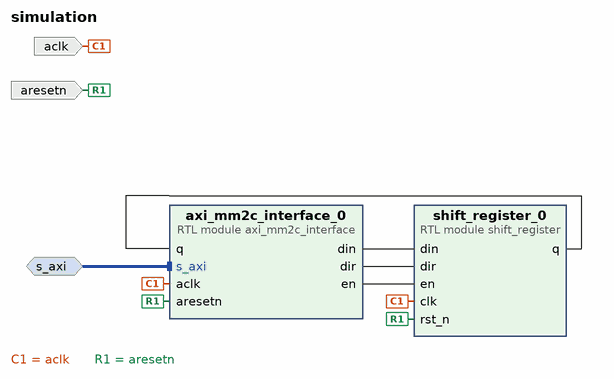
[diagram p0: block diagram of the top level]
# Vivado block design simulation, xc7z020clg484-1, Vivado 2023.2
create_bd_design simulation

create_bd_intf_port -mode Slave -vlnv xilinx.com:interface:aximm_rtl:1.0 s_axi
set_property -dict [list \
  CONFIG.ADDR_WIDTH 32 \
  CONFIG.ARUSER_WIDTH 0 \
  CONFIG.AWUSER_WIDTH 0 \
  CONFIG.BUSER_WIDTH 0 \
  CONFIG.DATA_WIDTH 32 \
  CONFIG.HAS_BRESP 1 \
  CONFIG.HAS_BURST 0 \
  CONFIG.HAS_CACHE 0 \
  CONFIG.HAS_LOCK 0 \
  CONFIG.HAS_PROT 0 \
  CONFIG.HAS_QOS 0 \
  CONFIG.HAS_REGION 0 \
  CONFIG.HAS_RRESP 1 \
  CONFIG.HAS_WSTRB 1 \
  CONFIG.ID_WIDTH 0 \
  CONFIG.MAX_BURST_LENGTH 1 \
  CONFIG.NUM_READ_OUTSTANDING 1 \
  CONFIG.NUM_READ_THREADS 1 \
  CONFIG.NUM_WRITE_OUTSTANDING 1 \
  CONFIG.NUM_WRITE_THREADS 1 \
  CONFIG.PROTOCOL AXI4LITE \
  CONFIG.READ_WRITE_MODE READ_WRITE \
  CONFIG.RUSER_BITS_PER_BYTE 0 \
  CONFIG.RUSER_WIDTH 0 \
  CONFIG.SUPPORTS_NARROW_BURST 0 \
  CONFIG.WUSER_BITS_PER_BYTE 0 \
  CONFIG.WUSER_WIDTH 0 \
] [get_bd_intf_ports s_axi]
create_bd_port -dir I -type clk aclk
set_property -dict {CONFIG.FREQ_HZ 100000000} [get_bd_ports aclk]
create_bd_port -dir I -type rst aresetn

create_bd_cell -type module -reference shift_register shift_register_0
create_bd_cell -type module -reference axi_mm2c_interface axi_mm2c_interface_0

# ---- connections ----

connect_bd_intf_net [get_bd_intf_pins axi_mm2c_interface_0/s_axi] [get_bd_intf_ports s_axi]
connect_bd_net [get_bd_ports aclk] [get_bd_pins axi_mm2c_interface_0/aclk] [get_bd_pins shift_register_0/clk]
connect_bd_net [get_bd_ports aresetn] [get_bd_pins axi_mm2c_interface_0/aresetn] [get_bd_pins shift_register_0/rst_n]
connect_bd_net [get_bd_pins axi_mm2c_interface_0/din] [get_bd_pins shift_register_0/din]
connect_bd_net [get_bd_pins axi_mm2c_interface_0/dir] [get_bd_pins shift_register_0/dir]
connect_bd_net [get_bd_pins axi_mm2c_interface_0/en] [get_bd_pins shift_register_0/en]
connect_bd_net [get_bd_pins shift_register_0/q] [get_bd_pins axi_mm2c_interface_0/q]

validate_bd_design
save_bd_design
